# EAGLE design Timer (EAGLE 7.7.0)
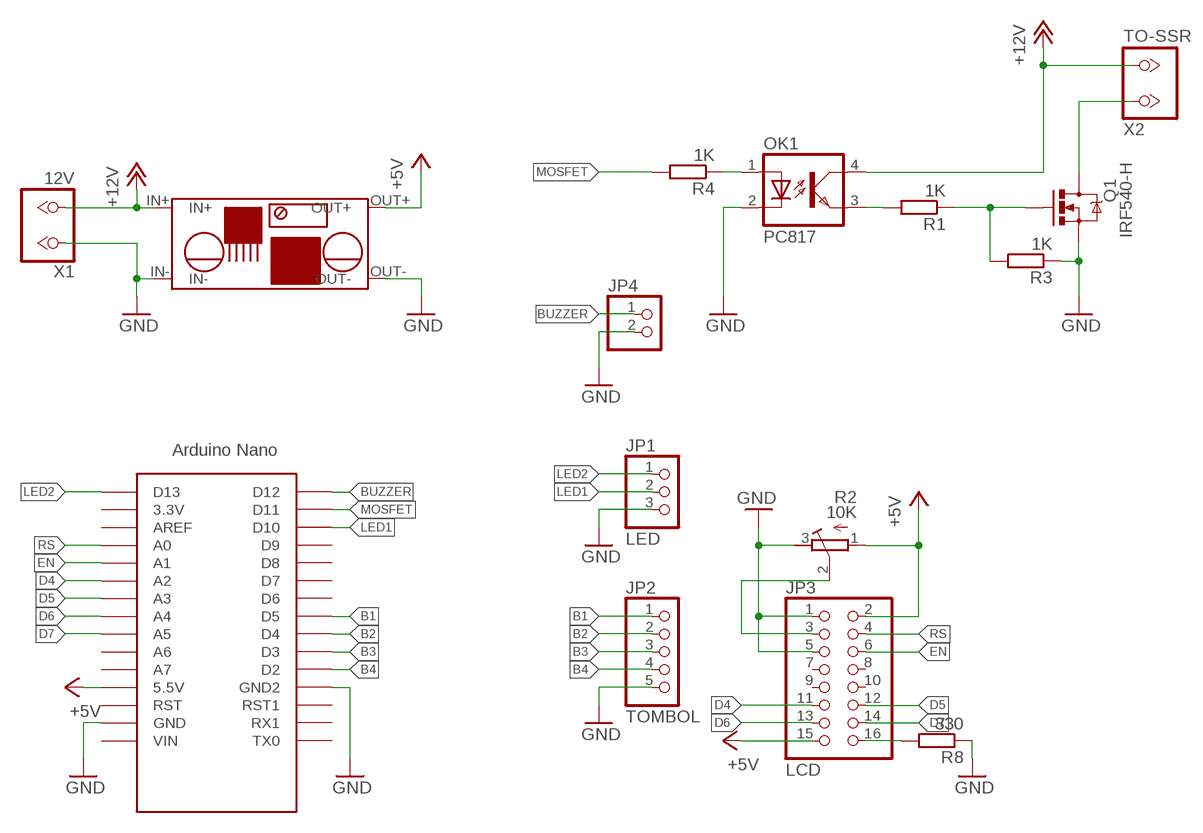
[diagram p0: schematic, sheet 1]

## Parts
JP1  LED  PINHD-1X3  [1X03]
JP2  TOMBOL  PINHD-1X5"  [1X05]
JP3  LCD  PINHD-2X8  [2X08]
JP4  PINHD-1X2  [1X02]
MOD1  LM2576  [LM2576]
OK1  PC817  [DIL04]
Q1  IRF540-H  [TO-220H]
R1  1K  R-EU_0207/7  [0207/7]
R2  10K  R-TRIMM3339  [RTRIM3339]
R3  1K  R-EU_0207/7  [0207/7]
R4  1K  R-EU_0207/7  [0207/7]
R8  330  R-EU_0207/7  [0207/7]
U$1  NANO  [NANO]
X1  12V  2PIN-SCREW  [KL2]
X2  TO-SSR  2PIN-SCREW  [KL2]

## Nets
+5V: JP3.2 JP3.15 MOD1.OUT+ R2.1(A) U$1.5V(5.5V)
+12V: MOD1.IN+ OK1.4(COL) X1.2 X2.2
B1: JP2.1 U$1.D5
B2: JP2.2 U$1.D4
B3: JP2.3 U$1.D3
B4: JP2.4 U$1.D2
BUZZER: JP4.1 U$1.D12
D4: JP3.11 U$1.A2
D5: JP3.12 U$1.A3
D6: JP3.13 U$1.A4
D7: JP3.14 U$1.A5
EN: JP3.6 U$1.A1
GND: JP1.3 JP2.5 JP3.1 JP3.5 JP4.2 MOD1.IN- MOD1.OUT- OK1.2(C) Q1.3(S) R2.3(E) R3.1 R8.1 U$1.GND U$1.GND1(GND2) X1.1
LED1: JP1.2 U$1.D10
LED2: JP1.1 U$1.D13
MOSFET: R4.2 U$1.D11
N$1: Q1.1(G) R1.1 R3.2
N$2: OK1.3(EMIT) R1.2
N$4: JP3.16 R8.2
N$5: Q1.2(D) X2.1
N$12: OK1.1(A) R4.1
N$23: JP3.3 R2.2(S)
RS: JP3.4 U$1.A0
Unconnected: JP3.7 JP3.8 JP3.9 JP3.10 U$1.3.3V U$1.A6 U$1.A7 U$1.AREF U$1.D6 U$1.D7 U$1.D8 U$1.D9 U$1.RST U$1.RST1 U$1.RX1 U$1.TX0 U$1.VIN

## Library data of the parts
JP1 = FansElectronics-Header:PINHD-1X3: PIN HEADER
JP2 = FansElectronics-Header:PINHD-1X5: PIN HEADER
JP3 = FansElectronics-Header:PINHD-2X8: PIN HEADER
JP4 = FansElectronics-Header:PINHD-1X2: PIN HEADER
MOD1 = FansElectronics-Modul:LM2576
OK1 = optocoupler:PC817: SHARP OPTO COUPLER; MPN: PC817X4J000F; OC_FARNELL: 9707727; OC_NEWARK: 97K7059
Q1 = FansElectronics-Mosfet:IRF540
R1 R3 R4 R8 = FansElectronics-RCL:R-EU_: RESISTOR, European symbol
R2 = FansElectronics-RCL:R-TRIMM: Trimm resistor
U$1 = Arduino-clone:NANO: Arduino Nano
X1 X2 = FansElectronics-Con-Screw:2PIN

## Board
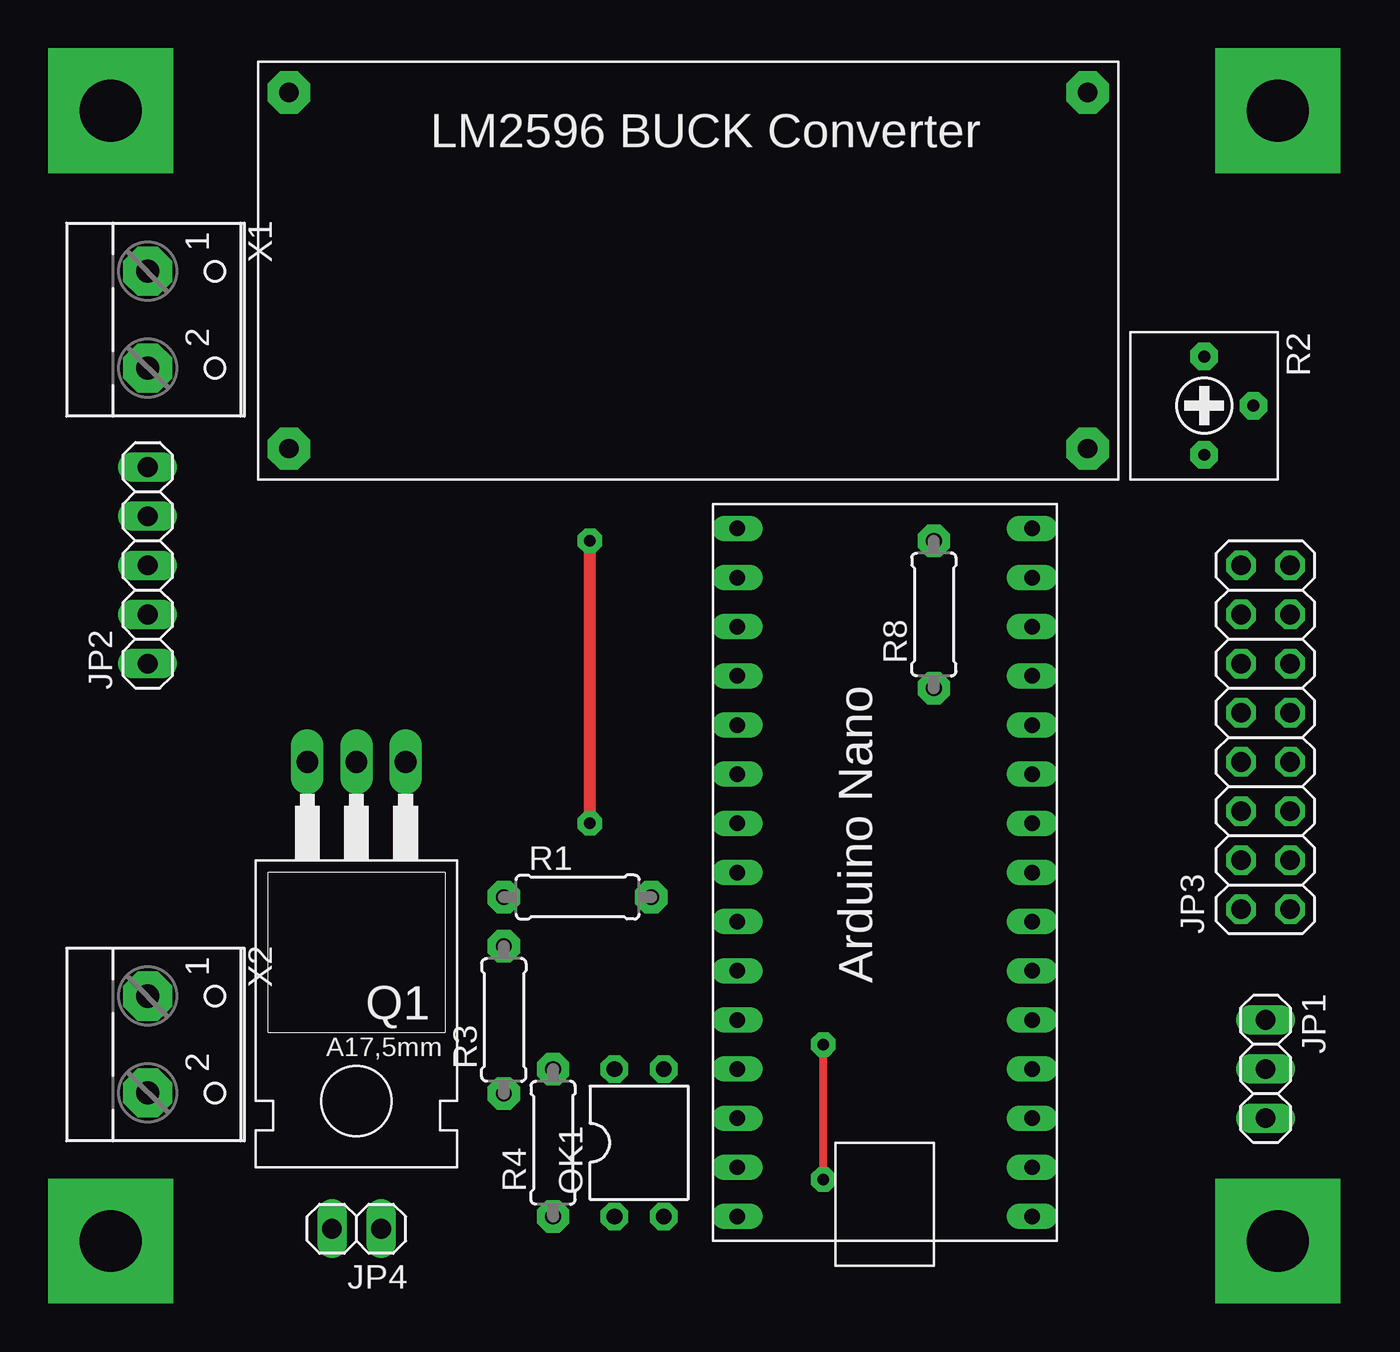
[diagram p1: board, top side]
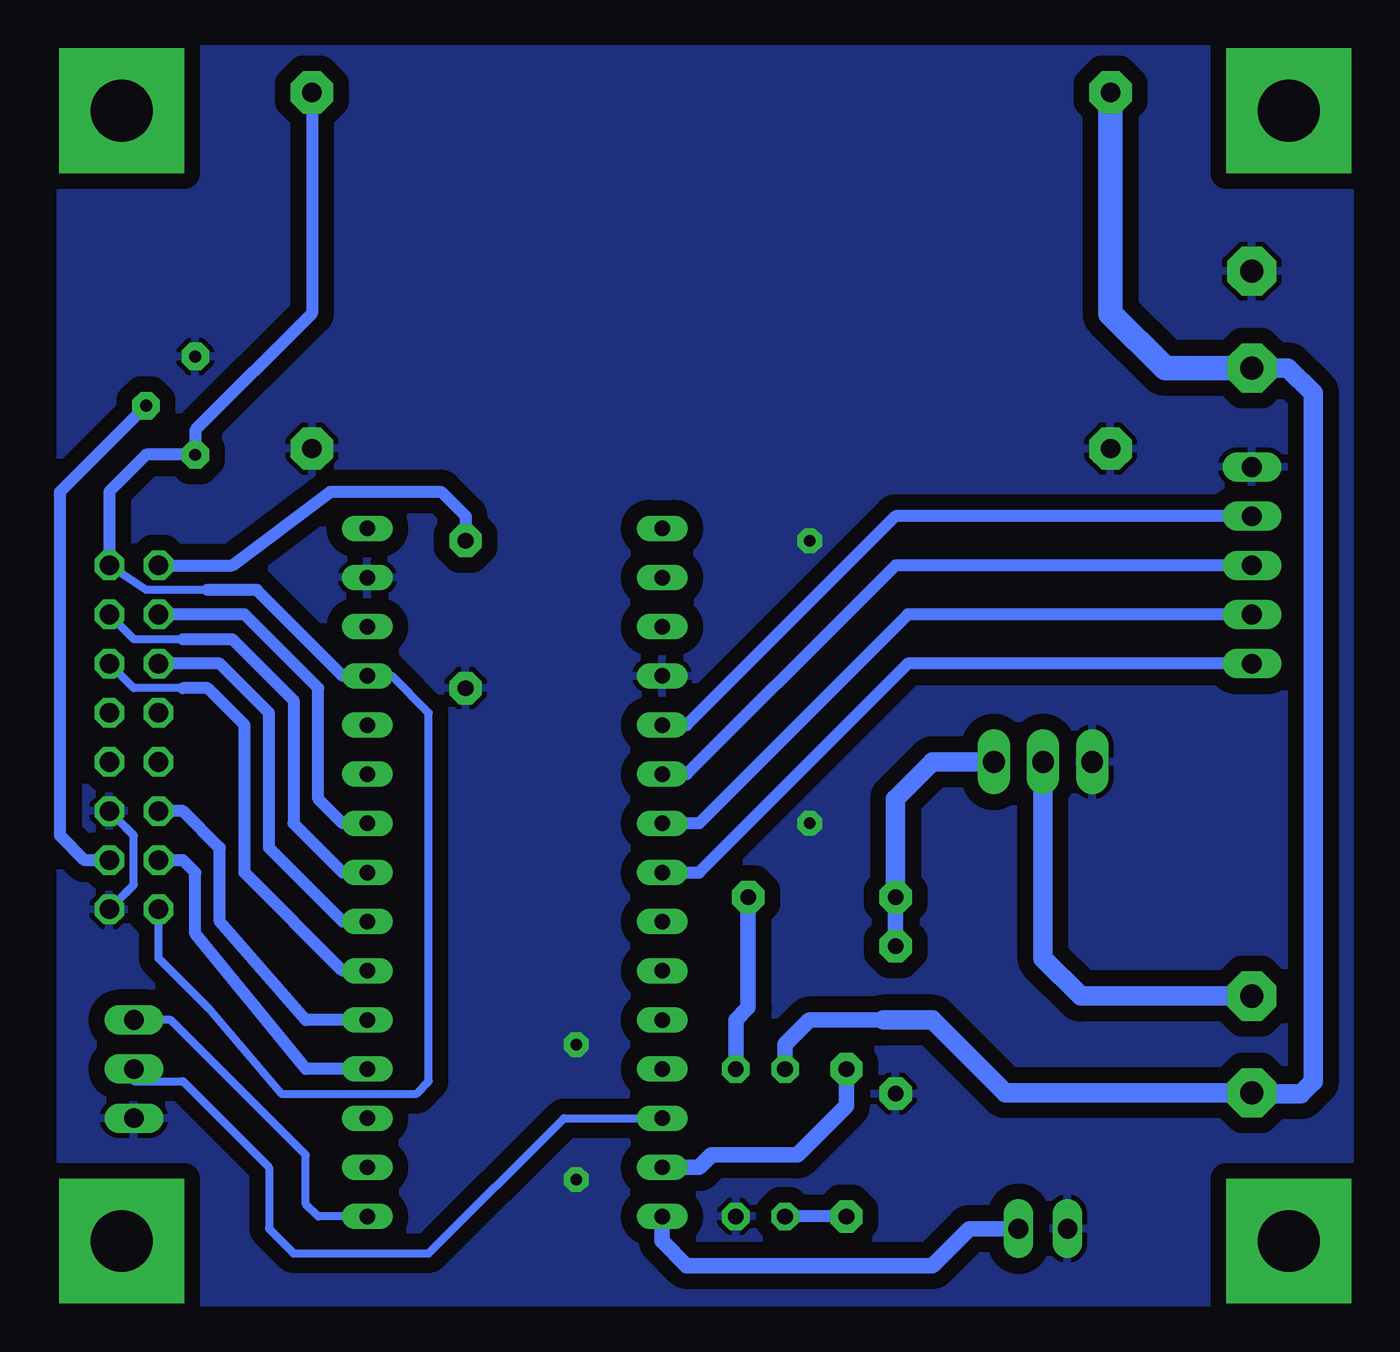
[diagram p2: board, bottom side, seen from below]

No outline drawn. Coordinates in mm, seen from the top.
Copper layers (1*16): Top 0.035mm / dielectric 1.5mm / Bottom 0.035mm
Design rules "default": minimum track width 10mil, minimum drill 24mil, track to track 8mil, track to pad 8mil, pad to pad 8mil, via to via 8mil, smd to smd 8mil, copper to edge 40mil, drill to drill 8mil, minimum pad ring 10mil, minimum via ring 8mil, stop-mask expansion 4mil, vias tented up to drill 0mil, thermal gap 10mil

### Footprints (pad centres in the part's own frame; a part is rotated, then mirrored left to right if it is on the bottom)
1X03 = drill 1.016 long: 1 -2.54,0; 2 0,0; 3 2.54,0
1X05 = drill 1.016 long: 1 -5.08,0; 2 -2.54,0; 3 0,0; 4 2.54,0; 5 5.08,0
2X08 = drill 1.016 octagon: 1 -8.89,-1.27; 2 -8.89,1.27; 3 -6.35,-1.27; 4 -6.35,1.27; 5 -3.81,-1.27; 6 -3.81,1.27; 7 -1.27,-1.27; 8 -1.27,1.27; 9 1.27,-1.27; 10 1.27,1.27; 11 3.81,-1.27; 12 3.81,1.27; 13 6.35,-1.27; 14 6.35,1.27; 15 8.89,-1.27; 16 8.89,1.27
1X02 = drill 1.016 long: 1 -1.27,0; 2 1.27,0
LM2576 = drill 1 pad 2.184 octagon: IN+ -20.003,9.842; IN- -20.003,-8.572; OUT+ 21.273,9.842; OUT- 21.273,-8.572
DIL04 = drill 0.813 pad 1.422 octagon: 1 -1.27,-3.81; 2 1.27,-3.81; 3 1.27,3.81; 4 -1.27,3.81
TO-220H = drill 1.118 long: 1 -2.54,-10.16; 2 0,-10.16; 3 2.54,-10.16
0207/7 = drill 0.813 pad 1.676 octagon: 1 -3.81,0; 2 3.81,0
RTRIM3339 = drill 0.61 pad 1.422 octagon: 1 2.54,0; 2 0,2.54; 3 -2.54,0
NANO = drill 0.8 long: 3.3V -10.16,24.13; 5V -10.16,-1.27; A0 -10.16,19.05; A1 -10.16,16.51; A2 -10.16,13.97; A3 -10.16,11.43; A4 -10.16,8.89; A5 -10.16,6.35; A6 -10.16,3.81; A7 -10.16,1.27; AREF -10.16,21.59; D2 5.08,1.27; D3 5.08,3.81; D4 5.08,6.35; D5 5.08,8.89; D6 5.08,11.43; D7 5.08,13.97; D8 5.08,16.51; D9 5.08,19.05; D10 5.08,21.59; D11 5.08,24.13; D12 5.08,26.67; D13 -10.16,26.67; GND -10.16,-6.35; GND1 5.08,-1.27; RST -10.16,-3.81; RST1 5.08,-3.81; RX1 5.08,-6.35; TX0 5.08,-8.89; VIN -10.16,-8.89
KL2 = drill 1.194 pad 2.54 octagon: 1 -2.5,0; 2 2.5,0

### Placement (x,y rotation side)
JP1  76.2,37.47 270 top
JP2  18.41,63.5 90 top
JP3  76.2,54.61 90 top
JP4  29.21,29.21 180 top
MOD1  45.72,78.11 0 top
OK1  43.81,33.66 0 top
Q1  29.21,43.18 180 top
R1  40.64,46.35 0 top
R2  73.03,71.75 270 top
R3  36.83,40.01 90 top
R4  39.37,33.66 90 top
R8  59.05,60.96 90 top
U$1  53.98,56.52 180 top
X1  18.41,76.2 270 top
X2  18.41,38.73 270 top

### Tracks (layer width: path | path; a pad name or v marks a point on that pad's centre or on a via)
+5V
  Bottom 0.406: 72.39,62.23 75.56,62.23 JP3.15 | U$1.5V 62.87,57.78 60.96,55.88 60.96,36.83 61.59,36.2 68.58,36.2 72.39,40.64 74.93,43.18 JP3.2
  Bottom 0.61: U$1.5V 65.41,57.78 69.85,62.23 72.39,62.23 | JP3.15 77.47,67.31 75.56,69.22 R2.1 73.03,70.48 66.99,76.52 MOD1.OUT+
+12V
  Bottom 0.813: OK1.4 42.55,38.73 41.27,40.01 37.47,40.01 36.83,40.01
  Bottom 1.016: 37.47,40.01 34.92,40.01 31.16,36.23 X2.2 18.38,36.2 15.88,36.2 15.24,36.83 15.24,72.39 16.55,73.7 22.9,73.7
  Bottom 1.27: X1.2 22.9,73.7 25.72,76.52 MOD1.IN+
B1
  Bottom 0.61: U$1.D5 46.99,47.62 36.2,58.42 JP2.1
B2
  Bottom 0.61: JP2.2 36.2,60.96 46.99,50.16 U$1.D4
B3
  Bottom 0.61: U$1.D3 47.62,52.7 38.42,61.91 37.47,62.87 36.83,63.5 JP2.3
B4
  Bottom 0.61: JP2.4 36.83,66.04 47.62,55.24 U$1.D2
BUZZER
  Bottom 0.813: JP4.1 33.02,29.21 34.92,27.3 47.62,27.3 48.9,28.57 U$1.D12
D4
  Bottom 0.406: 73.66,57.15 76.2,57.15 JP3.11
  Bottom 0.61: U$1.A2 65.41,42.55 70.48,47.62 70.48,55.24 72.39,57.15 73.66,57.15
D5
  Bottom 0.61: U$1.A3 65.41,45.09 69.22,48.9 69.22,55.88 71.75,58.42 JP3.12
D6
  Bottom 0.406: JP3.13 76.2,59.69 73.66,59.69
  Bottom 0.61: 73.66,59.69 71.12,59.69 67.94,56.52 67.94,50.16 65.41,47.62 U$1.A4
D7
  Bottom 0.61: U$1.A5 65.41,50.16 66.67,51.44 66.67,57.15 70.48,60.96 JP3.14
EN
  Bottom 0.61: U$1.A1 67.31,40.01 71.75,45.09 71.75,48.9 73.66,50.8 JP3.6
GND  (via drill 0.6 pad 1.27)
  Top 0.406: v53.34,31.75 v53.34,38.73
  Top 0.61: v41.27,50.16 v41.27,64.77
  Bottom 0.406: JP3.1 76.2,46.99 76.2,49.53 JP3.5
  pour Bottom (isolate 0.813): 13.34,90.17 80.01,90.17 80.01,25.4 13.34,25.4
LED1
  Bottom 0.406: JP1.2 76.2,36.83 73.66,36.83 69.22,32.38 69.22,29.21 67.94,27.94 60.96,27.94 53.98,34.92 U$1.D10
LED2
  Bottom 0.406: U$1.D13 66.67,29.84 67.31,30.48 67.31,33.02 74.3,40.01 JP1.1
MOSFET
  Bottom 0.813: R4.2 39.37,35.56 41.91,33.02 46.35,33.02 46.99,32.38 U$1.D11
N$1
  Bottom 0.813: R3.2 R1.1
  Bottom 1.016: Q1.1 34.92,53.34 36.83,51.44 R1.1
N$2
  Bottom 0.813: OK1.3 45.09,40.01 44.45,40.64 R1.2
N$3  (via drill 3.2 pad 6.45)
  other vias: 16.51,87
N$4
  Bottom 0.61: JP3.16 71.12,63.5 66.04,67.31 60.33,67.31 59.05,66.04 R8.2
N$5
  Bottom 1.016: X2.1 27.27,41.23 29.21,43.18 Q1.2
N$6  (via drill 3.2 pad 6.45)
  other vias: 16.51,28.57
N$7  (via drill 3.2 pad 6.45)
  other vias: 76.83,28.57
N$9  (via drill 3.2 pad 6.45)
  other vias: 76.83,87
N$12
  Bottom 0.61: R4.1 OK1.1
N$23
  Bottom 0.61: JP3.3 78.74,48.26 80.01,49.53 80.01,67.31 R2.2
RS
  Bottom 0.61: U$1.A0 67.31,37.47 73.03,44.45 73.03,47.62 73.66,48.26 JP3.4

### Text on the board
tPlace: LM2596 BUCK Converter | Arduino Nano